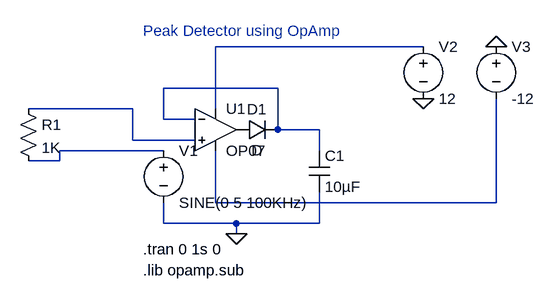
[diagram p0: schematic PeakDetectorOpAmp.asc]
PeakDetectorOpAmp.asc, the LTspice schematic file:
Version 4
SHEET 1 880 680
WIRE 432 -48 112 -48
WIRE 208 16 32 16
WIRE -16 48 -176 48
WIRE 112 48 112 -48
WIRE 32 64 32 16
WIRE 80 64 32 64
WIRE 208 80 208 16
WIRE 272 80 208 80
WIRE -16 96 -16 48
WIRE 80 96 -16 96
WIRE 32 112 -128 112
WIRE 272 112 272 80
WIRE -128 128 -128 112
WIRE -128 128 -176 128
WIRE 112 192 112 112
WIRE 544 192 544 32
WIRE 544 192 112 192
WIRE 32 224 32 192
WIRE 144 224 32 224
WIRE 272 224 272 176
WIRE 272 224 144 224
WIRE 144 240 144 224
FLAG 144 240 0
FLAG 432 32 0
FLAG 544 -48 0
DATAFLAG 480 32 ""
SYMBOL voltage 32 96 R0
WINDOW 123 0 0 Left 0
WINDOW 39 0 0 Left 0
SYMATTR InstName V1
SYMATTR Value SINE(0 5 100KHz)
SYMBOL cap 256 112 R0
SYMATTR InstName C1
SYMATTR Value 10µF
SYMBOL diode 144 96 R270
WINDOW 0 32 32 VTop 2
WINDOW 3 0 32 VBottom 2
SYMATTR InstName D1
SYMBOL OpAmps\\OP07 112 16 R0
SYMATTR InstName U1
SYMBOL voltage 432 -64 R0
WINDOW 123 0 0 Left 0
WINDOW 39 0 0 Left 0
SYMATTR InstName V2
SYMATTR Value 12
SYMBOL voltage 544 -64 R0
WINDOW 123 0 0 Left 0
WINDOW 39 0 0 Left 0
SYMATTR InstName V3
SYMATTR Value -12
SYMBOL res -192 32 R0
SYMATTR InstName R1
SYMATTR Value 1K
TEXT 0 264 Left 2 !.tran 0 1s 0
TEXT 0 -72 Left 2 ;Peak Detector using OpAmp
TEXT 0 296 Left 2 !.lib opamp.sub

The netlist it stands for:
* PeakDetectorOpAmp.asc
V1 N004 0 SINE(0 5 100KHz)
C1 N002 0 10µF
D1 P001 N002 D
XU1 N003 N002 N001 N005 P001 LT1001  ; OP07, pins In+ In- V+ V- OUT
V2 N001 0 12
V3 0 N005 -12
R1 N003 N004 1K
.model D D
.lib standard.dio
.tran 0 1s 0
* Peak Detector using OpAmp
.lib opamp.sub
.lib LTC.lib
.backanno
.end